# Altium schematic sheet [3]-DAC.SchDoc
size A3; SheetNumber: 3; SheetTotal: 3
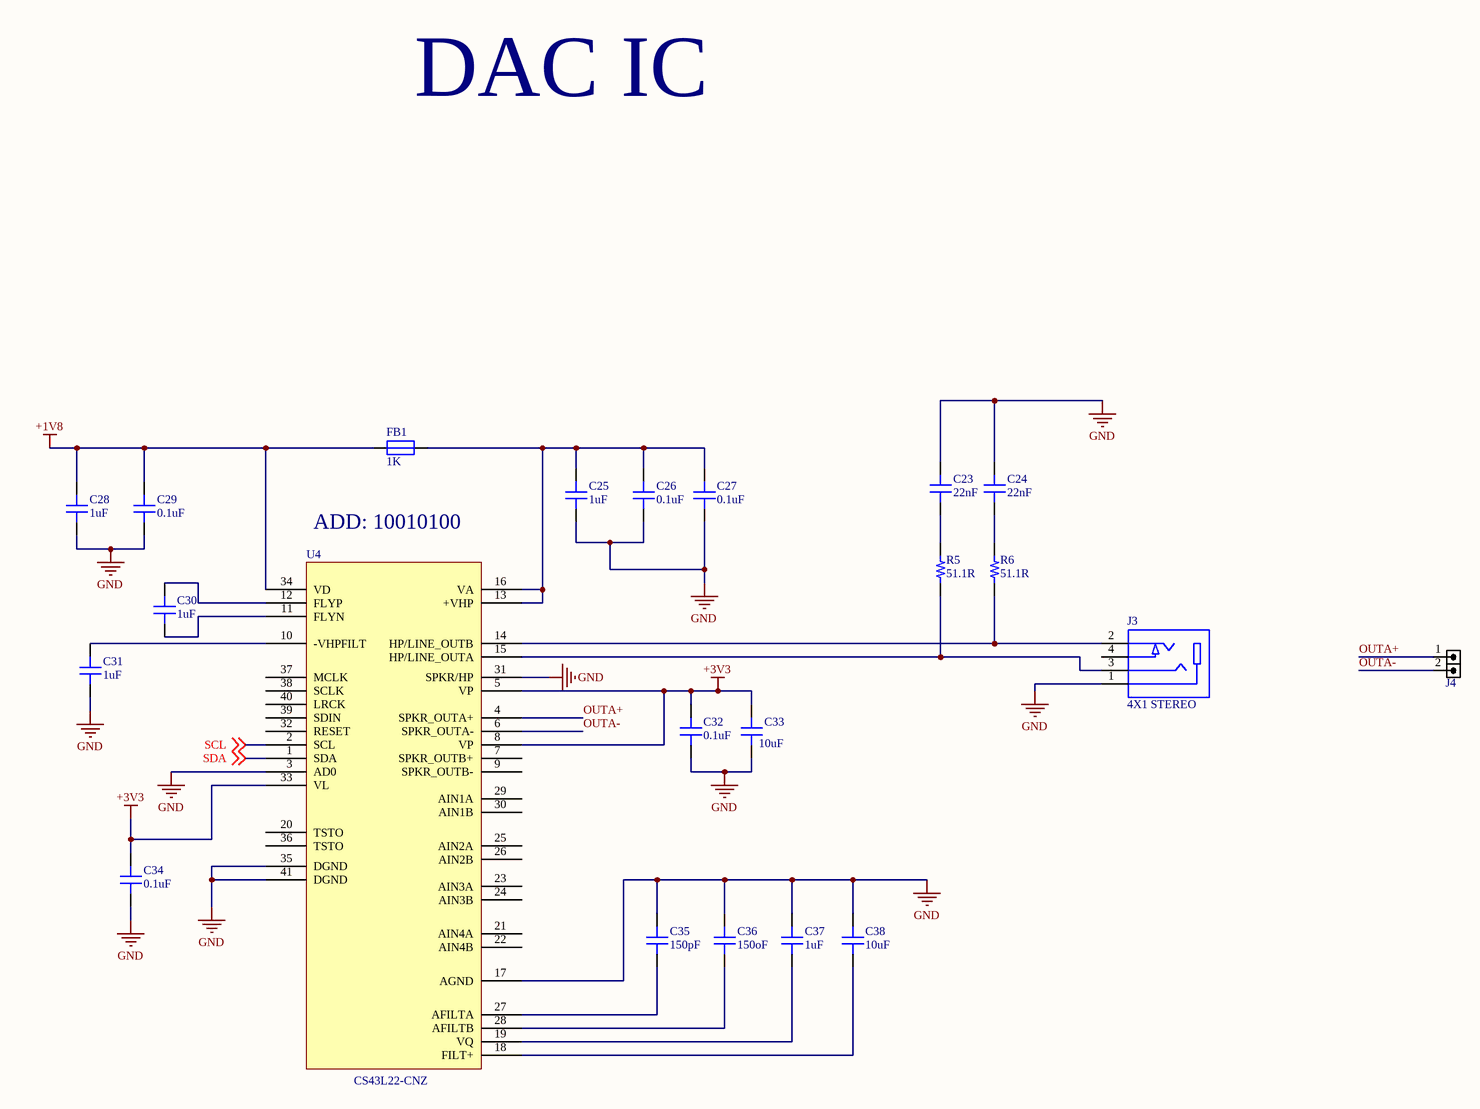
[diagram p0: [3]-DAC.SchDoc]

## Parts
C23  22nF  [CAP 0603_1608]
C24  22nF  [CAP 0603_1608]
C25  1uF  [CAP 0603_1608]
C26  0.1uF  [CAP 0603_1608]
C27  0.1uF  [CAP 0603_1608]
C28  1uF  [CAP 0603_1608]
C29  0.1uF  [CAP 0603_1608]
C30  1uF  [CAP 0603_1608]
C31  1uF  [CAP 0603_1608]
C32  0.1uF  [CAP 0603_1608]
C33  10uF  [CAP 0603_1608]
C34  0.1uF  [CAP 0603_1608]
C35  150pF  [CAP 0603_1608]
C36  150oF  [CAP 0603_1608]
C37  1uF  [CAP 0603_1608]
C38  10uF  [CAP 0603_1608]
FB1  1K  [IND_0805]
J3  4X1 STEREO  [CON_SJ-2504A-SMT-TR_SMD]
J4  HDR2  [HDR1SE_M_1X2]  (value not drawn)
R5  51.1R  [RES 0603_1608]
R6  51.1R  [RES 0603_1608]
U4  CS43L22-CNZ  [QFN40_19_284_33X9_SMD]

## Nets
+1V8: C28.2 C29.2 FB1.1 U4.34(VD)
+3V3: C32.2 C33.2 C34.2 U4.5(VP) U4.8(VP) U4.33(VL)
GND: C23.2 C24.2 C25.1 C26.1 C27.1 C28.1 C29.1 C31.1 C32.1 C33.1 C34.1 C35.2 C36.2 C37.2 C38.2 J3.1 U4.3(AD0) U4.17(AGND) U4.31(SPKR/HP) U4.35(DGND) U4.41(DGND)
OUTA+: J4.1 U4.4(SPKR_OUTA+)
OUTA-: J4.2 U4.6(SPKR_OUTA-)
SCL: U4.2(SCL) ; off-sheet SCL
SDA: U4.1(SDA) ; off-sheet SDA
NetC23_1: C23.1 R5.2
NetC24_1: C24.1 R6.2
NetC25_2: C25.2 C26.2 C27.2 FB1.2 U4.13(+VHP) U4.16(VA)
NetC30_1: C30.1 U4.12(FLYP)
NetC30_2: C30.2 U4.11(FLYN)
NetC31_2: C31.2 U4.10(-VHPFILT)
NetC35_1: C35.1 U4.27(AFILTA)
NetC36_1: C36.1 U4.28(AFILTB)
NetC37_1: C37.1 U4.19(VQ)
NetC38_1: C38.1 U4.18(FILT+)
NetJ3_2: J3.2 R6.1 U4.14(HP/LINE_OUTB)
NetJ3_3: J3.3 R5.1 U4.15(HP/LINE_OUTA)

Not connected (* = marked no-connect by the designer): J3 4; U4 7(SPKR_OUTB+) 9(SPKR_OUTB-) 20(TSTO) 21(AIN4A) 22(AIN4B) 23(AIN3A) 24(AIN3B) 25(AIN2A) 26(AIN2B) 29(AIN1A) 30(AIN1B) 32(RESET) 36(TSTO) 37(MCLK) 38(SCLK) 39(SDIN) 40(LRCK)

## Notes on the sheet
- DAC IC
- ADD: 10010100

## Library data of the parts
C23-C38 = Cap 0603: SMT Capacitor; VALUE: 100nF
FB1 = FB_1K-100MHZ-1.6A-0805: 1 kOhms @ 100MHz 1 Power Line Ferrite Bead 0805 (2012 Metric) 1.6A; Manufacturer: Laird; Manufacturer Part Number: BLM21SP102SH1D; Alternate Part Number-1: NA; Case/Package: 0805; Supplier-1: SIRICOM; Supplier Part Number-1: ACMS201209A102
J3 = CON-PLG-STEREO_4X1-100-RA-SMD: 2.50mm (0.094", 3/32", Sub Mini, Miniature) - Headphone Phone Jack Stereo (4 Conductor, TRRS) Connector Solder; Manufacturer: CUI Devices; Manufacturer Part Number: SJ-2504A-SMT-TR; Alternate Part Number-1: NA; Case/Package: SMD; Supplier Part Number-1: CP-SJ-2504A-SMT-CT-ND - Cut Tape (CT); Supplier-1: Digikey
J4 = HDRTST_1X2: HEADER, 1mm pitch, test, SMD; VALUE: HDR2
R5 R6 = Res 0603: SMT Resistor; VALUE: 1K
U4 = IC_CS43L22: Audio D/A Converter ICs Low Power Stereo DAC w/ClassD Spkr Driver; Manufacturer: Cirrus Logic; Alternate Part Number-1: NA; Manufacturer Part Number: CS43L22-CNZ; Case/Package: QFN-40; Supplier-1: Mouser; Supplier Part Number-1: 777-CS43L22-CNZ